# Altium schematic sheet Nestling_2.1_EXB_Interface.SchDoc
size A4
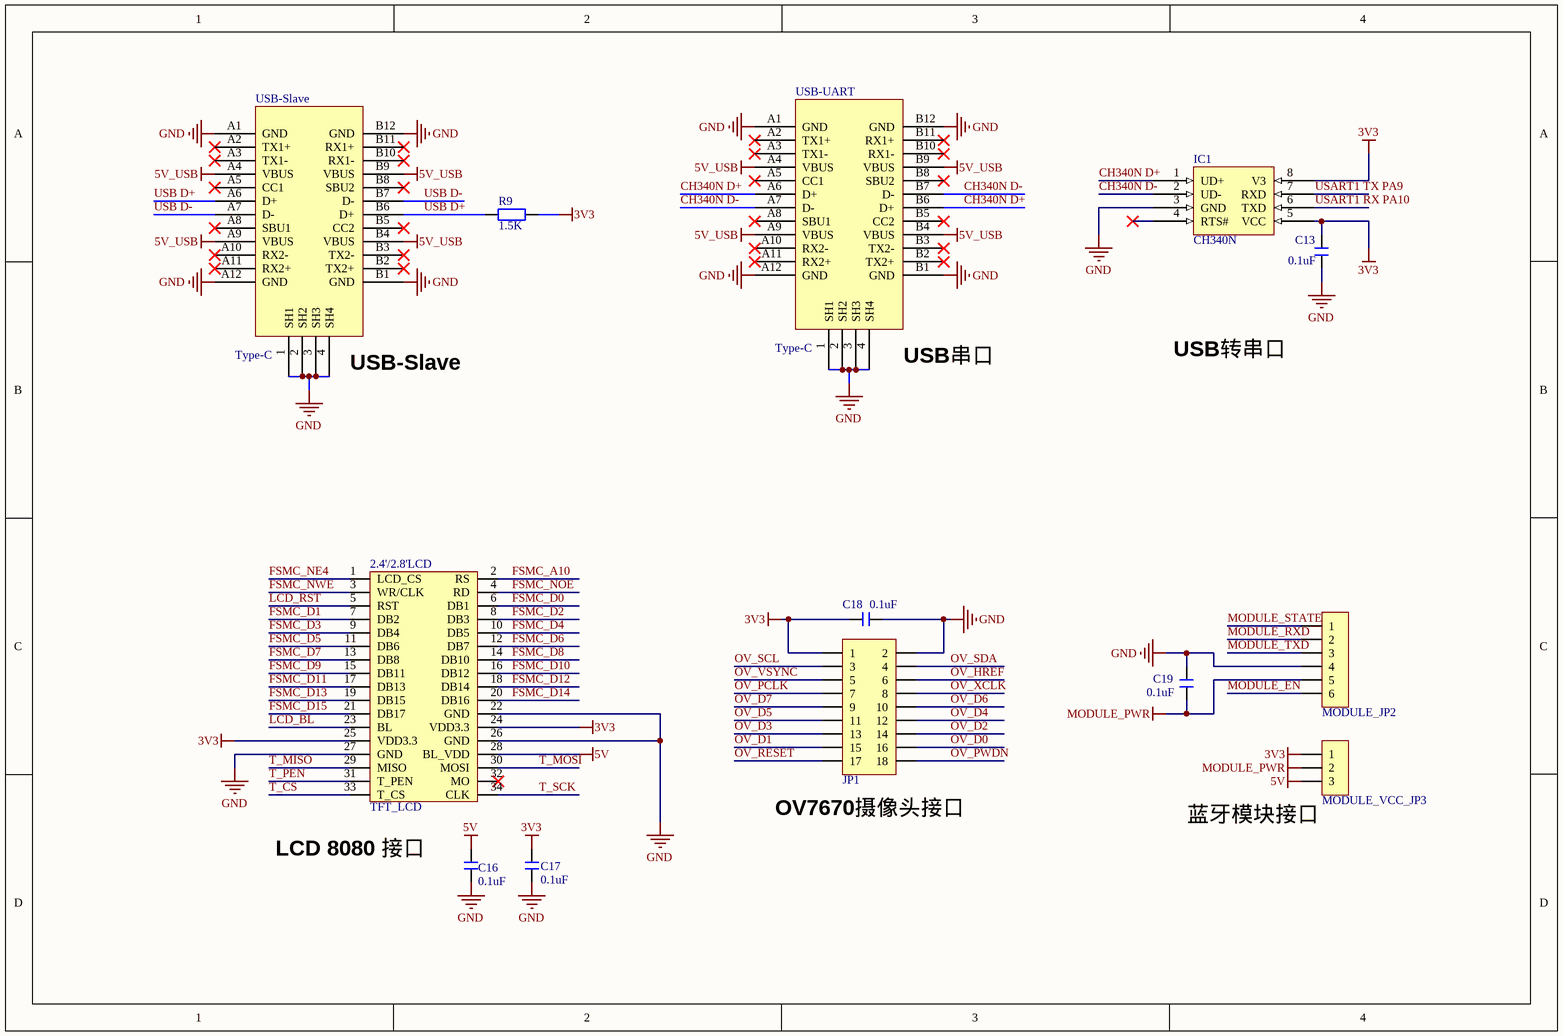
[diagram p0: Nestling_2.1_EXB_Interface.SchDoc]

## Parts
2.4'/2.8'LCD  TFT_LCD  [db2*17-4.3]
C13  0.1uF  [C 0603_M]
C16  0.1uF  [C 0603_M]
C17  0.1uF  [C 0603_M]
C18  0.1uF  [C 0603_M]
C19  0.1uF  [C 0603_M]
IC1  CH340N  [SOP8_N]
JP1  Header 9X2  [HDR2.54-LI-2x9P]  (value not drawn)
MODULE_JP2  HDR-1X6  [HDR2.54-M-LI-6P]  (value not drawn)
MODULE_VCC_JP3  HDR-1X3  [HDR2.54-LI-3P]  (value not drawn)
R9  1.5K  [R 0603_M]
USB-Slave  Type-C  [Type-C]
USB-UART  Type-C  [Type-C]

## Nets
3V3: 2.4'/2.8'LCD.24(VDD3.3) 2.4'/2.8'LCD.25(VDD3.3) C13.2 C17.1 C18.1 IC1.5(VCC) IC1.8(V3) JP1.1 MODULE_VCC_JP3.1 R9.1
5V: 2.4'/2.8'LCD.28(BL_VDD) C16.2 MODULE_VCC_JP3.3
5V_USB: USB-Slave.A4(VBUS) USB-Slave.A9(VBUS) USB-Slave.B4(VBUS) USB-Slave.B9(VBUS) USB-UART.A4(VBUS) USB-UART.A9(VBUS) USB-UART.B4(VBUS) USB-UART.B9(VBUS)
GND: 2.4'/2.8'LCD.22(GND) 2.4'/2.8'LCD.26(GND) 2.4'/2.8'LCD.27(GND) C13.1 C16.1 C17.2 C18.2 C19.2 IC1.3(GND) JP1.2 MODULE_JP2.4 USB-Slave.1(SH1) USB-Slave.2(SH2) USB-Slave.3(SH3) USB-Slave.4(SH4) USB-Slave.A1(GND) USB-Slave.A12(GND) USB-Slave.B1(GND) USB-Slave.B12(GND) USB-UART.1(SH1) USB-UART.2(SH2) USB-UART.3(SH3) USB-UART.4(SH4) USB-UART.A1(GND) USB-UART.A12(GND) USB-UART.B1(GND) USB-UART.B12(GND)
MODULE_PWR: C19.1 MODULE_JP2.5 MODULE_VCC_JP3.2
CH340N D+: IC1.1(UD+) USB-UART.A6(D+) USB-UART.B6(D+)
CH340N D-: IC1.2(UD-) USB-UART.A7(D-) USB-UART.B7(D-)
FSMC_A10: 2.4'/2.8'LCD.2(RS)
FSMC_D0: 2.4'/2.8'LCD.6(DB1)
FSMC_D1: 2.4'/2.8'LCD.7(DB2)
FSMC_D2: 2.4'/2.8'LCD.8(DB3)
FSMC_D3: 2.4'/2.8'LCD.9(DB4)
FSMC_D4: 2.4'/2.8'LCD.10(DB5)
FSMC_D5: 2.4'/2.8'LCD.11(DB6)
FSMC_D6: 2.4'/2.8'LCD.12(DB7)
FSMC_D7: 2.4'/2.8'LCD.13(DB8)
FSMC_D8: 2.4'/2.8'LCD.14(DB10)
FSMC_D9: 2.4'/2.8'LCD.15(DB11)
FSMC_D10: 2.4'/2.8'LCD.16(DB12)
FSMC_D11: 2.4'/2.8'LCD.17(DB13)
FSMC_D12: 2.4'/2.8'LCD.18(DB14)
FSMC_D13: 2.4'/2.8'LCD.19(DB15)
FSMC_D14: 2.4'/2.8'LCD.20(DB16)
FSMC_D15: 2.4'/2.8'LCD.21(DB17)
FSMC_NE4: 2.4'/2.8'LCD.1(LCD_CS)
FSMC_NOE: 2.4'/2.8'LCD.4(RD)
FSMC_NWE: 2.4'/2.8'LCD.3(WR/CLK)
LCD_BL: 2.4'/2.8'LCD.23(BL)
LCD_RST: 2.4'/2.8'LCD.5(RST)
MODULE_EN: MODULE_JP2.6
MODULE_RXD: MODULE_JP2.2
MODULE_STATE: MODULE_JP2.1
MODULE_TXD: MODULE_JP2.3
OV_D0: JP1.16
OV_D1: JP1.15
OV_D2: JP1.14
OV_D3: JP1.13
OV_D4: JP1.12
OV_D5: JP1.11
OV_D6: JP1.10
OV_D7: JP1.9
OV_HREF: JP1.6
OV_PCLK: JP1.7
OV_PWDN: JP1.18
OV_RESET: JP1.17
OV_SCL: JP1.3
OV_SDA: JP1.4
OV_VSYNC: JP1.5
OV_XCLK: JP1.8
T_CS: 2.4'/2.8'LCD.33(T_CS)
T_MISO: 2.4'/2.8'LCD.29(MISO)
T_MOSI: 2.4'/2.8'LCD.30(MOSI)
T_PEN: 2.4'/2.8'LCD.31(T_PEN)
T_SCK: 2.4'/2.8'LCD.34(CLK)
USART1 RX PA10: IC1.6(TXD)
USART1 TX PA9: IC1.7(RXD)
USB D+: R9.2 USB-Slave.A6(D+) USB-Slave.B6(D+)
USB D-: USB-Slave.A7(D-) USB-Slave.B7(D-)

Not connected (* = marked no-connect by the designer): 2.4'/2.8'LCD 32(MO)*; IC1 4(RTS#)*; USB-Slave A2(TX1+)* A3(TX1-)* A5(CC1)* A8(SBU1)* A10(RX2-)* A11(RX2+)* B2(TX2+)* B3(TX2-)* B5(CC2)* B8(SBU2)* B10(RX1-)* B11(RX1+)*; USB-UART A2(TX1+)* A3(TX1-)* A5(CC1)* A8(SBU1)* A10(RX2-)* A11(RX2+)* B2(TX2+)* B3(TX2-)* B5(CC2)* B8(SBU2)* B10(RX1-)* B11(RX1+)*

## Notes on the sheet
- (near USB-Slave) USB-Slave
- (near USB-UART) USB串口
- USB转串口
- (near JP1) OV7670摄像头接口
- 蓝牙模块接口
- (near 2.4'/2.8'LCD) LCD 8080 接口

## Library data of the parts
C13 C16-C19 = C: 无极性贴片电容; 版权归属: 源创客; BOM名称: 无极性贴片电容; 学习资源: www.ooocke.com
IC1 = CH340N: USB 转串口芯片 CH330/CH340N
JP1 = Header 9X2: 9*2P接插件; 版权归属: 源创客; BOM名称: 9*2P接插件; 学习资源: www.ooocke.com
MODULE_JP2 = Header 6: 6P接插件; 版权归属: 源创客; BOM名称: 6P接插件; 学习资源: www.ooocke.com
MODULE_VCC_JP3 = Header 3: 3P接插件; 版权归属: 源创客; BOM名称: 3P接插件; 学习资源: www.ooocke.com
R9 = RES: Resistor